# Altium schematic sheet 01.SchDoc
size 420 x 496 mm
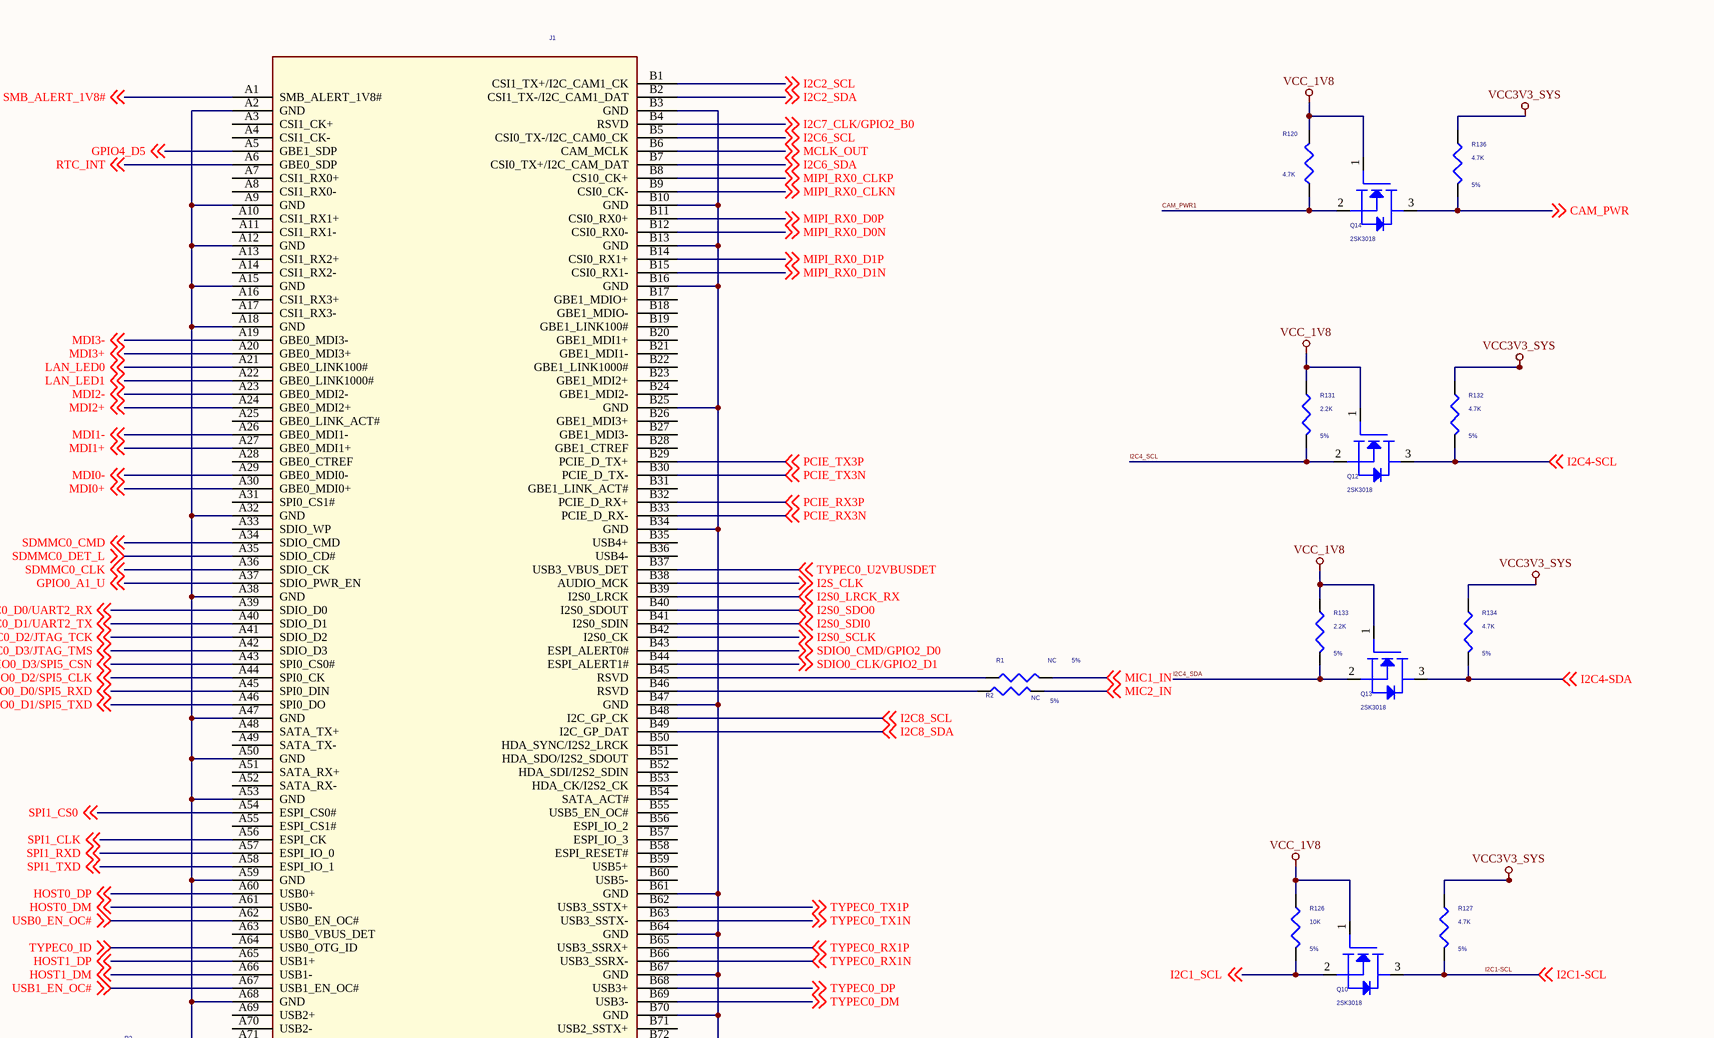
[diagram p0: 01.SchDoc, top]
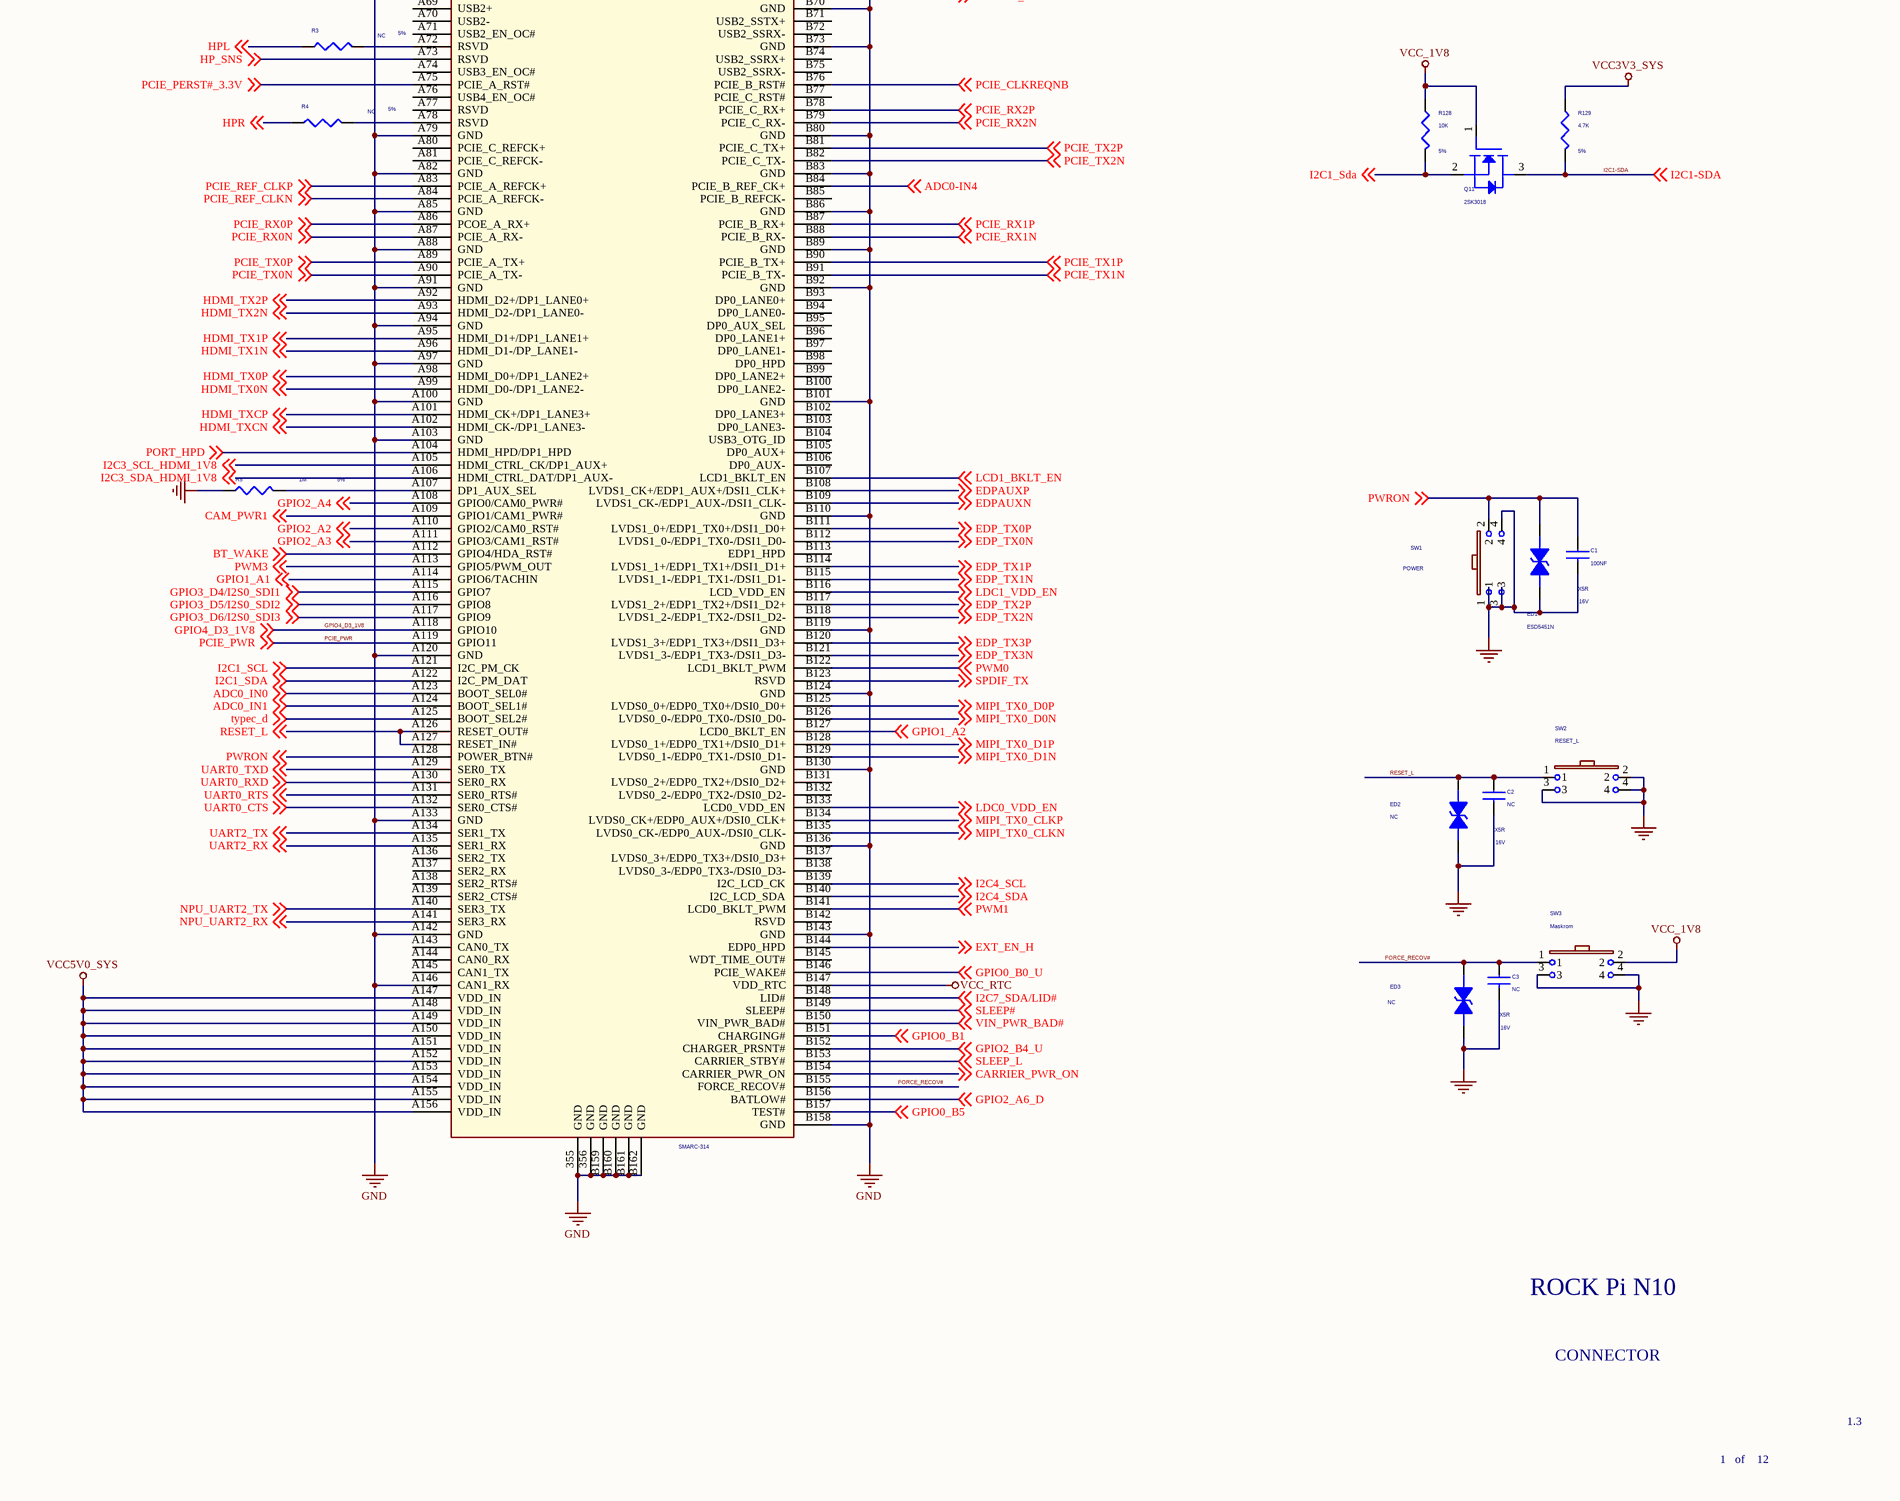
[diagram p1: 01.SchDoc, bottom]

## Parts
C1  100NF  Dielectric: X5R  Voltage: 16V  [C0402]
C2  NC  Dielectric: X5R  Voltage: 16V  [C0402]
C3  NC  Dielectric: X5R  Voltage: 16V  [C0402]
ED1  ESD5451N  [ESD0402]
ED2  NC  [ESD0402]
ED3  NC  [ESD0402]
J1  SMARC-314  [SMARC-314C]
Q10  2SK3018  [SOT23]
Q11  2SK3018  [SOT23]
Q12  2SK3018  [SOT23]
Q13  2SK3018  [SOT23]
Q14  2SK3018  [SOT23]
R1  NC  Tolerance: 5%  [R0402]
R2  NC  Tolerance: 5%  [R0402]
R3  NC  Tolerance: 5%  [R0402]
R4  NC  Tolerance: 5%  [R0402]
R5  1M  Tolerance: 5%  [R0402]
R120  4.7K  [R0402]
R126  10K  Tolerance: 5%  [R0402]
R127  4.7K  Tolerance: 5%  [R0402]
R128  10K  Tolerance: 5%  [R0402]
R129  4.7K  Tolerance: 5%  [R0402]
R131  2.2K  Tolerance: 5%  [R0402]
R132  4.7K  Tolerance: 5%  [R0402]
R133  2.2K  Tolerance: 5%  [R0402]
R134  4.7K  Tolerance: 5%  [R0402]
R136  4.7K  Tolerance: 5%  [R0402]
SW1  POWER  [YC-6615B]
SW2  RESET_L  [YC-6615B]
SW3  Maskrom  [YC-6615B]

## Nets
GND: C1.2 C2.2 C3.2 ED1.2 ED2.2 ED3.2 J1.355(GND) J1.356(GND) J1.A2(GND) J1.A9(GND) J1.A12(GND) J1.A15(GND) J1.A18(GND) J1.A32(GND) J1.A38(GND) J1.A47(GND) J1.A50(GND) J1.A53(GND) J1.A59(GND) J1.A68(GND) J1.A79(GND) J1.A82(GND) J1.A85(GND) J1.A88(GND) J1.A91(GND) J1.A94(GND) J1.A97(GND) J1.A100(GND) J1.A103(GND) J1.A120(GND) J1.A133(GND) J1.A142(GND) J1.A146(CAN1_RX) J1.B3(GND) J1.B10(GND) J1.B13(GND) J1.B16(GND) J1.B25(GND) J1.B34(GND) J1.B47(GND) J1.B61(GND) J1.B64(GND) J1.B67(GND) J1.B70(GND) J1.B73(GND) J1.B80(GND) J1.B83(GND) J1.B86(GND) J1.B89(GND) J1.B92(GND) J1.B101(GND) J1.B110(GND) J1.B119(GND) J1.B124(GND) J1.B130(GND) J1.B136(GND) J1.B143(GND) J1.B158(GND) J1.B159(GND) J1.B160(GND) J1.B161(GND) J1.B162(GND) R5.1 SW1.1 SW1.3 SW1.4 SW2.2 SW2.3 SW2.4 SW3.3 SW3.4
VCC3V3_SYS: R127.1 R129.1 R132.1 R134.1 R136.1
VCC5V0_SYS: J1.A147(VDD_IN) J1.A148(VDD_IN) J1.A149(VDD_IN) J1.A150(VDD_IN) J1.A151(VDD_IN) J1.A152(VDD_IN) J1.A153(VDD_IN) J1.A154(VDD_IN) J1.A155(VDD_IN) J1.A156(VDD_IN)
VCC_1V8: Q10.1(GATE) Q11.1(GATE) Q12.1(GATE) Q13.1(GATE) Q14.1(GATE) R120.2 R126.1 R128.1 R131.1 R133.1 SW3.2
VCC_RTC: J1.B147(VDD_RTC)
ADC0-IN4: J1.B84(PCIE_B_REF_CK+) ; off-sheet ADC0-IN4
ADC0_IN0: J1.A123(BOOT_SEL0#) ; off-sheet ADC0_IN0
ADC0_IN1: J1.A124(BOOT_SEL1#) ; off-sheet ADC0_IN1
BT_WAKE: J1.A112(GPIO4/HDA_RST#) ; off-sheet BT_WAKE
CAM_PWR: Q14.3(DRAIN) R136.2 ; off-sheet CAM_PWR
CAM_PWR1: J1.A109(GPIO1/CAM1_PWR#) Q14.2(SOURCE) R120.1 ; off-sheet CAM_PWR1
CARRIER_PWR_ON: J1.B154(CARRIER_PWR_ON) ; off-sheet CARRIER_PWR_ON
EDP_TX0N: J1.B112(LVDS1_0-/EDP1_TX0-/DSI1_D0-) ; off-sheet EDP_TX0N
EDP_TX0P: J1.B111(LVDS1_0+/EDP1_TX0+/DSI1_D0+) ; off-sheet EDP_TX0P
EDP_TX1N: J1.B115(LVDS1_1-/EDP1_TX1-/DSI1_D1-) ; off-sheet EDP_TX1N
EDP_TX1P: J1.B114(LVDS1_1+/EDP1_TX1+/DSI1_D1+) ; off-sheet EDP_TX1P
EDP_TX2N: J1.B118(LVDS1_2-/EDP1_TX2-/DSI1_D2-) ; off-sheet EDP_TX2N
EDP_TX2P: J1.B117(LVDS1_2+/EDP1_TX2+/DSI1_D2+) ; off-sheet EDP_TX2P
EDP_TX3N: J1.B121(LVDS1_3-/EDP1_TX3-/DSI1_D3-) ; off-sheet EDP_TX3N
EDP_TX3P: J1.B120(LVDS1_3+/EDP1_TX3+/DSI1_D3+) ; off-sheet EDP_TX3P
EDPAUXN: J1.B109(LVDS1_CK-/EDP1_AUX-/DSI1_CLK-) ; off-sheet EDPAUXN
EDPAUXP: J1.B108(LVDS1_CK+/EDP1_AUX+/DSI1_CLK+) ; off-sheet EDPAUXP
EXT_EN_H: J1.B144(EDP0_HPD) ; off-sheet EXT_EN_H
FORCE_RECOV#: C3.1 ED3.1 J1.B155(FORCE_RECOV#) SW3.1
GPIO0_A1_U: J1.A37(SDIO_PWR_EN) ; off-sheet GPIO0_A1_U
GPIO0_B0_U: J1.B146(PCIE_WAKE#) ; off-sheet GPIO0_B0_U
GPIO0_B1: J1.B151(CHARGING#) ; off-sheet GPIO0_B1
GPIO0_B5: J1.B157(TEST#) ; off-sheet GPIO0_B5
GPIO1_A1: J1.A114(GPIO6/TACHIN) ; off-sheet GPIO1_A1
GPIO1_A2: J1.B127(LCD0_BKLT_EN) ; off-sheet GPIO1_A2
GPIO2_A2: J1.A110(GPIO2/CAM0_RST#) ; off-sheet GPIO2_A2
GPIO2_A3: J1.A111(GPIO3/CAM1_RST#) ; off-sheet GPIO2_A3
GPIO2_A4: J1.A108(GPIO0/CAM0_PWR#) ; off-sheet GPIO2_A4
GPIO2_A6_D: J1.B156(BATLOW#) ; off-sheet GPIO2_A6_D
GPIO2_B4_U: J1.B152(CHARGER_PRSNT#) ; off-sheet GPIO2_B4_U
GPIO3_D4/I2S0_SDI1: J1.A115(GPIO7) ; off-sheet GPIO3_D4/I2S0_SDI1
GPIO3_D5/I2S0_SDI2: J1.A116(GPIO8) ; off-sheet GPIO3_D5/I2S0_SDI2
GPIO3_D6/I2S0_SDI3: J1.A117(GPIO9) ; off-sheet GPIO3_D6/I2S0_SDI3
GPIO4_D3_1V8: J1.A118(GPIO10) ; off-sheet GPIO4_D3_1V8
GPIO4_D5: J1.A5(GBE1_SDP) ; off-sheet GPIO4_D5
HDMI_TX0N: J1.A99(HDMI_D0-/DP1_LANE2-) ; off-sheet HDMI_TX0N
HDMI_TX0P: J1.A98(HDMI_D0+/DP1_LANE2+) ; off-sheet HDMI_TX0P
HDMI_TX1N: J1.A96(HDMI_D1-/DP_LANE1-) ; off-sheet HDMI_TX1N
HDMI_TX1P: J1.A95(HDMI_D1+/DP1_LANE1+) ; off-sheet HDMI_TX1P
HDMI_TX2N: J1.A93(HDMI_D2-/DP1_LANE0-) ; off-sheet HDMI_TX2N
HDMI_TX2P: J1.A92(HDMI_D2+/DP1_LANE0+) ; off-sheet HDMI_TX2P
HDMI_TXCN: J1.A102(HDMI_CK-/DP1_LANE3-) ; off-sheet HDMI_TXCN
HDMI_TXCP: J1.A101(HDMI_CK+/DP1_LANE3+) ; off-sheet HDMI_TXCP
HOST0_DM: J1.A61(USB0-) ; off-sheet HOST0_DM
HOST0_DP: J1.A60(USB0+) ; off-sheet HOST0_DP
HOST1_DM: J1.A66(USB1-) ; off-sheet HOST1_DM
HOST1_DP: J1.A65(USB1+) ; off-sheet HOST1_DP
HP_SNS: J1.A73(RSVD) ; off-sheet HP_SNS
HPL: R3.1 ; off-sheet HPL
HPR: R4.1 ; off-sheet HPR
I2C1-SCL: Q10.3(DRAIN) R127.2 ; off-sheet I2C1-SCL
I2C1-SDA: Q11.3(DRAIN) R129.2 ; off-sheet I2C1-SDA
I2C1_SCL: J1.A121(I2C_PM_CK) Q10.2(SOURCE) R126.2 ; off-sheet I2C1_SCL
I2C1_SDA: J1.A122(I2C_PM_DAT) Q11.2(SOURCE) R128.2 ; off-sheet I2C1_SDA, off-sheet I2C1_Sda
I2C2_SCL: J1.B1(CSI1_TX+/I2C_CAM1_CK) ; off-sheet I2C2_SCL
I2C2_SDA: J1.B2(CSI1_TX-/I2C_CAM1_DAT) ; off-sheet I2C2_SDA
I2C3_SCL_HDMI_1V8: J1.A105(HDMI_CTRL_CK/DP1_AUX+) ; off-sheet I2C3_SCL_HDMI_1V8
I2C3_SDA_HDMI_1V8: J1.A106(HDMI_CTRL_DAT/DP1_AUX-) ; off-sheet I2C3_SDA_HDMI_1V8
I2C4-SCL: Q12.3(DRAIN) R132.2 ; off-sheet I2C4-SCL
I2C4-SDA: Q13.3(DRAIN) R134.2 ; off-sheet I2C4-SDA
I2C4_SCL: J1.B139(I2C_LCD_CK) Q12.2(SOURCE) R131.2 ; off-sheet I2C4_SCL
I2C4_SDA: J1.B140(I2C_LCD_SDA) Q13.2(SOURCE) R133.2 ; off-sheet I2C4_SDA
I2C6_SCL: J1.B5(CSI0_TX-/I2C_CAM0_CK) ; off-sheet I2C6_SCL
I2C6_SDA: J1.B7(CSI0_TX+/I2C_CAM_DAT) ; off-sheet I2C6_SDA
I2C7_CLK/GPIO2_B0: J1.B4(RSVD) ; off-sheet I2C7_CLK/GPIO2_B0
I2C7_SDA/LID#: J1.B148(LID#) ; off-sheet I2C7_SDA/LID#
I2C8_SCL: J1.B48(I2C_GP_CK) ; off-sheet I2C8_SCL
I2C8_SDA: J1.B49(I2C_GP_DAT) ; off-sheet I2C8_SDA
I2S0_LRCK_RX: J1.B39(I2S0_LRCK) ; off-sheet I2S0_LRCK_RX
I2S0_SCLK: J1.B42(I2S0_CK) ; off-sheet I2S0_SCLK
I2S0_SDI0: J1.B41(I2S0_SDIN) ; off-sheet I2S0_SDI0
I2S0_SDO0: J1.B40(I2S0_SDOUT) ; off-sheet I2S0_SDO0
I2S_CLK: J1.B38(AUDIO_MCK) ; off-sheet I2S_CLK
LAN_LED0: J1.A21(GBE0_LINK100#) ; off-sheet LAN_LED0
LAN_LED1: J1.A22(GBE0_LINK1000#) ; off-sheet LAN_LED1
LCD1_BKLT_EN: J1.B107(LCD1_BKLT_EN) ; off-sheet LCD1_BKLT_EN
LDC0_VDD_EN: J1.B133(LCD0_VDD_EN) ; off-sheet LDC0_VDD_EN
LDC1_VDD_EN: J1.B116(LCD_VDD_EN) ; off-sheet LDC1_VDD_EN
MCLK_OUT: J1.B6(CAM_MCLK) ; off-sheet MCLK_OUT
MDI0+: J1.A30(GBE0_MDI0+) ; off-sheet MDI0+
MDI0-: J1.A29(GBE0_MDI0-) ; off-sheet MDI0-
MDI1+: J1.A27(GBE0_MDI1+) ; off-sheet MDI1+
MDI1-: J1.A26(GBE0_MDI1-) ; off-sheet MDI1-
MDI2+: J1.A24(GBE0_MDI2+) ; off-sheet MDI2+
MDI2-: J1.A23(GBE0_MDI2-) ; off-sheet MDI2-
MDI3+: J1.A20(GBE0_MDI3+) ; off-sheet MDI3+
MDI3-: J1.A19(GBE0_MDI3-) ; off-sheet MDI3-
MIC1_IN: R1.2 ; off-sheet MIC1_IN
MIC2_IN: R2.2 ; off-sheet MIC2_IN
MIPI_RX0_CLKN: J1.B9(CSI0_CK-) ; off-sheet MIPI_RX0_CLKN
MIPI_RX0_CLKP: J1.B8(CS10_CK+) ; off-sheet MIPI_RX0_CLKP
MIPI_RX0_D0N: J1.B12(CSI0_RX0-) ; off-sheet MIPI_RX0_D0N
MIPI_RX0_D0P: J1.B11(CSI0_RX0+) ; off-sheet MIPI_RX0_D0P
MIPI_RX0_D1N: J1.B15(CSI0_RX1-) ; off-sheet MIPI_RX0_D1N
MIPI_RX0_D1P: J1.B14(CSI0_RX1+) ; off-sheet MIPI_RX0_D1P
MIPI_TX0_CLKN: J1.B135(LVDS0_CK-/EDP0_AUX-/DSI0_CLK-) ; off-sheet MIPI_TX0_CLKN
MIPI_TX0_CLKP: J1.B134(LVDS0_CK+/EDP0_AUX+/DSI0_CLK+) ; off-sheet MIPI_TX0_CLKP
MIPI_TX0_D0N: J1.B126(LVDS0_0-/EDP0_TX0-/DSI0_D0-) ; off-sheet MIPI_TX0_D0N
MIPI_TX0_D0P: J1.B125(LVDS0_0+/EDP0_TX0+/DSI0_D0+) ; off-sheet MIPI_TX0_D0P
MIPI_TX0_D1N: J1.B129(LVDS0_1-/EDP0_TX1-/DSI0_D1-) ; off-sheet MIPI_TX0_D1N
MIPI_TX0_D1P: J1.B128(LVDS0_1+/EDP0_TX1+/DSI0_D1+) ; off-sheet MIPI_TX0_D1P
NPU_UART2_RX: J1.A141(SER3_RX) ; off-sheet NPU_UART2_RX
NPU_UART2_TX: J1.A140(SER3_TX) ; off-sheet NPU_UART2_TX
PCIE_CLKREQNB: J1.B76(PCIE_B_RST#) ; off-sheet PCIE_CLKREQNB
PCIE_PERST#_3.3V: J1.A75(PCIE_A_RST#) ; off-sheet PCIE_PERST#_3.3V
PCIE_PWR: J1.A119(GPIO11) ; off-sheet PCIE_PWR
PCIE_REF_CLKN: J1.A84(PCIE_A_REFCK-) ; off-sheet PCIE_REF_CLKN
PCIE_REF_CLKP: J1.A83(PCIE_A_REFCK+) ; off-sheet PCIE_REF_CLKP
PCIE_RX0N: J1.A87(PCIE_A_RX-) ; off-sheet PCIE_RX0N
PCIE_RX0P: J1.A86(PCOE_A_RX+) ; off-sheet PCIE_RX0P
PCIE_RX1N: J1.B88(PCIE_B_RX-) ; off-sheet PCIE_RX1N
PCIE_RX1P: J1.B87(PCIE_B_RX+) ; off-sheet PCIE_RX1P
PCIE_RX2N: J1.B79(PCIE_C_RX-) ; off-sheet PCIE_RX2N
PCIE_RX2P: J1.B78(PCIE_C_RX+) ; off-sheet PCIE_RX2P
PCIE_RX3N: J1.B33(PCIE_D_RX-) ; off-sheet PCIE_RX3N
PCIE_RX3P: J1.B32(PCIE_D_RX+) ; off-sheet PCIE_RX3P
PCIE_TX0N: J1.A90(PCIE_A_TX-) ; off-sheet PCIE_TX0N
PCIE_TX0P: J1.A89(PCIE_A_TX+) ; off-sheet PCIE_TX0P
PCIE_TX1N: J1.B91(PCIE_B_TX-) ; off-sheet PCIE_TX1N
PCIE_TX1P: J1.B90(PCIE_B_TX+) ; off-sheet PCIE_TX1P
PCIE_TX2N: J1.B82(PCIE_C_TX-) ; off-sheet PCIE_TX2N
PCIE_TX2P: J1.B81(PCIE_C_TX+) ; off-sheet PCIE_TX2P
PCIE_TX3N: J1.B30(PCIE_D_TX-) ; off-sheet PCIE_TX3N
PCIE_TX3P: J1.B29(PCIE_D_TX+) ; off-sheet PCIE_TX3P
PORT_HPD: J1.A104(HDMI_HPD/DP1_HPD) ; off-sheet PORT_HPD
PWM0: J1.B122(LCD1_BKLT_PWM) ; off-sheet PWM0
PWM1: J1.B141(LCD0_BKLT_PWM) ; off-sheet PWM1
PWM3: J1.A113(GPIO5/PWM_OUT) ; off-sheet PWM3
PWRON: C1.1 ED1.1 J1.A128(POWER_BTN#) SW1.2 ; off-sheet PWRON
RESET_L: C2.1 ED2.1 J1.A126(RESET_OUT#) J1.A127(RESET_IN#) SW2.1 ; off-sheet RESET_L
RTC_INT: J1.A6(GBE0_SDP) ; off-sheet RTC_INT
SDIO0_CLK/GPIO2_D1: J1.B44(ESPI_ALERT1#) ; off-sheet SDIO0_CLK/GPIO2_D1
SDIO0_CMD/GPIO2_D0: J1.B43(ESPI_ALERT0#) ; off-sheet SDIO0_CMD/GPIO2_D0
SDIO0_D0/SPI5_RXD: J1.A45(SPI0_DIN) ; off-sheet SDIO0_D0/SPI5_RXD
SDIO0_D1/SPI5_TXD: J1.A46(SPI0_DO) ; off-sheet SDIO0_D1/SPI5_TXD
SDIO0_D2/SPI5_CLK: J1.A44(SPI0_CK) ; off-sheet SDIO0_D2/SPI5_CLK
SDIO0_D3/SPI5_CSN: J1.A43(SPI0_CS0#) ; off-sheet SDIO0_D3/SPI5_CSN
SDMMC0_CLK: J1.A36(SDIO_CK) ; off-sheet SDMMC0_CLK
SDMMC0_CMD: J1.A34(SDIO_CMD) ; off-sheet SDMMC0_CMD
SDMMC0_D0/UART2_RX: J1.A39(SDIO_D0) ; off-sheet SDMMC0_D0/UART2_RX
SDMMC0_D1/UART2_TX: J1.A40(SDIO_D1) ; off-sheet SDMMC0_D1/UART2_TX
SDMMC0_D2/JTAG_TCK: J1.A41(SDIO_D2) ; off-sheet SDMMC0_D2/JTAG_TCK
SDMMC0_D3/JTAG_TMS: J1.A42(SDIO_D3) ; off-sheet SDMMC0_D3/JTAG_TMS
SDMMC0_DET_L: J1.A35(SDIO_CD#) ; off-sheet SDMMC0_DET_L
SLEEP#: J1.B149(SLEEP#) ; off-sheet SLEEP#
SLEEP_L: J1.B153(CARRIER_STBY#) ; off-sheet SLEEP_L
SMB_ALERT_1V8#: J1.A1(SMB_ALERT_1V8#) ; off-sheet SMB_ALERT_1V8#
SPDIF_TX: J1.B123(RSVD) ; off-sheet SPDIF_TX
SPI1_CLK: J1.A56(ESPI_CK) ; off-sheet SPI1_CLK
SPI1_CS0: J1.A54(ESPI_CS0#) ; off-sheet SPI1_CS0
SPI1_RXD: J1.A57(ESPI_IO_0) ; off-sheet SPI1_RXD
SPI1_TXD: J1.A58(ESPI_IO_1) ; off-sheet SPI1_TXD
TYPEC0_DM: J1.B69(USB3-) ; off-sheet TYPEC0_DM
TYPEC0_DP: J1.B68(USB3+) ; off-sheet TYPEC0_DP
TYPEC0_ID: J1.A64(USB0_OTG_ID) ; off-sheet TYPEC0_ID
TYPEC0_RX1N: J1.B66(USB3_SSRX-) ; off-sheet TYPEC0_RX1N
TYPEC0_RX1P: J1.B65(USB3_SSRX+) ; off-sheet TYPEC0_RX1P
TYPEC0_TX1N: J1.B63(USB3_SSTX-) ; off-sheet TYPEC0_TX1N
TYPEC0_TX1P: J1.B62(USB3_SSTX+) ; off-sheet TYPEC0_TX1P
TYPEC0_U2VBUSDET: J1.B37(USB3_VBUS_DET) ; off-sheet TYPEC0_U2VBUSDET
typec_d: J1.A125(BOOT_SEL2#) ; off-sheet typec_d
UART0_CTS: J1.A132(SER0_CTS#) ; off-sheet UART0_CTS
UART0_RTS: J1.A131(SER0_RTS#) ; off-sheet UART0_RTS
UART0_RXD: J1.A130(SER0_RX) ; off-sheet UART0_RXD
UART0_TXD: J1.A129(SER0_TX) ; off-sheet UART0_TXD
UART2_RX: J1.A135(SER1_RX) ; off-sheet UART2_RX
UART2_TX: J1.A134(SER1_TX) ; off-sheet UART2_TX
USB0_EN_OC#: J1.A62(USB0_EN_OC#) ; off-sheet USB0_EN_OC#
USB1_EN_OC#: J1.A67(USB1_EN_OC#) ; off-sheet USB1_EN_OC#
VIN_PWR_BAD#: J1.B150(VIN_PWR_BAD#) ; off-sheet VIN_PWR_BAD#
NetJ1_A72: J1.A72(RSVD) R3.2
NetJ1_A78: J1.A78(RSVD) R4.2
NetJ1_A107: J1.A107(DP1_AUX_SEL) R5.2
NetJ1_B45: J1.B45(RSVD) R1.1
NetJ1_B46: J1.B46(RSVD) R2.1

Not connected (* = marked no-connect by the designer): J1 A3(CSI1_CK+) A4(CSI1_CK-) A7(CSI1_RX0+) A8(CSI1_RX0-) A10(CSI1_RX1+) A11(CSI1_RX1-) A13(CSI1_RX2+) A14(CSI1_RX2-) A16(CSI1_RX3+) A17(CSI1_RX3-) A25(GBE0_LINK_ACT#) A28(GBE0_CTREF) A31(SPI0_CS1#) A33(SDIO_WP) A48(SATA_TX+) A49(SATA_TX-) A51(SATA_RX+) A52(SATA_RX-) A55(ESPI_CS1#) A63(USB0_VBUS_DET) A69(USB2+) A70(USB2-) A71(USB2_EN_OC#) A74(USB3_EN_OC#) A76(USB4_EN_OC#) A77(RSVD) A80(PCIE_C_REFCK+) A81(PCIE_C_REFCK-) A136(SER2_TX) A137(SER2_RX) A138(SER2_RTS#) A139(SER2_CTS#) A143(CAN0_TX) A144(CAN0_RX) A145(CAN1_TX) B17(GBE1_MDIO+) B18(GBE1_MDIO-) B19(GBE1_LINK100#) B20(GBE1_MDI1+) B21(GBE1_MDI1-) B22(GBE1_LINK1000#) B23(GBE1_MDI2+) B24(GBE1_MDI2-) B26(GBE1_MDI3+) B27(GBE1_MDI3-) B28(GBE1_CTREF) B31(GBE1_LINK_ACT#) B35(USB4+) B36(USB4-) B50(HDA_SYNC/I2S2_LRCK) B51(HDA_SDO/I2S2_SDOUT) B52(HDA_SDI/I2S2_SDIN) B53(HDA_CK/I2S2_CK) B54(SATA_ACT#) B55(USB5_EN_OC#) B56(ESPI_IO_2) B57(ESPI_IO_3) B58(ESPI_RESET#) B59(USB5+) B60(USB5-) B71(USB2_SSTX+) B72(USB2_SSRX-) B74(USB2_SSRX+) B75(USB2_SSRX-) B77(PCIE_C_RST#) B85(PCIE_B_REFCK-) B93(DP0_LANE0+) B94(DP0_LANE0-) B95(DP0_AUX_SEL) B96(DP0_LANE1+) B97(DP0_LANE1-) B98(DP0_HPD) B99(DP0_LANE2+) B100(DP0_LANE2-) B102(DP0_LANE3+) B103(DP0_LANE3-) B104(USB3_OTG_ID) B105(DP0_AUX+) B106(DP0_AUX-) B113(EDP1_HPD) B131(LVDS0_2+/EDP0_TX2+/DSI0_D2+) B132(LVDS0_2-/EDP0_TX2-/DSI0_D2-) B137(LVDS0_3+/EDP0_TX3+/DSI0_D3+) B138(LVDS0_3-/EDP0_TX3-/DSI0_D3-) B142(RSVD) B145(WDT_TIME_OUT#)

## Notes on the sheet
- ROCK Pi N10
- CONNECTOR
- 1.3
- 1   of    12

## Library data of the parts
C1 = CAP NP_2: cap,100.00nF,+/-10%,16V,X5R,C0402; Manufacturer: TDK; RK PN: C1005X5R1C104K050BA; Priority: A; Tolerance: 10%; Part Type: C0402; Manufacturer PN: C1005X5R1C104K050BA; Created by: JJJ
C2 C3 = CAP NP_2: cap,100.00nF,+/-10%,16V,X5R,C0402; Manufacturer PN: C1005X5R1C104K050BA; Manufacturer: TDK; Tolerance: 10%; Priority: A; Created by: JJJ; Part Type: C0402; RK PN: C1005X5R1C104K050BA
ED1 = DIODE BI_DIR TRIG_0: 1-Line, Bi-directional, Transient Voltage Suppressors.17.5pF.; Manufacturer: WillSemi(韦尔半导体); Priority: A; RK PN: ESD5451N; Part Type: ESD_TVS; Manufacturer PN: ESD5451N; Created by: JJJ
ED2 = DIODE BI_DIR TRIG_0: 1-Line, Bi-directional, Transient Voltage Suppressors.17.5pF.; Manufacturer: WillSemi(韦尔半导体); RK PN: ESD5451N; Priority: A; Part Type: ESD_TVS; Manufacturer PN: ESD5451N; Created by: JJJ
ED3 = DIODE BI_DIR TRIG_0: 1-Line, Bi-directional, Transient Voltage Suppressors.17.5pF.; Manufacturer PN: ESD5451N; Manufacturer: WillSemi(韦尔半导体); Priority: A; Created by: JJJ; Part Type: ESD_TVS; RK PN: ESD5451N
J1 = SMARC-314_3
Q10-Q13 = MOSFET N: NMOS,2SK3018,SOT_323,Id=0.1A,Vds=30V; Manufacturer: ROHM; Rds: 5ohm; Priority: A; Id_max: 0.1A; Vgs: 20V; VDS: 30V; Vgsth: 1.5V; Pd: 0.2W; RK PN: 2SK3018; Part Type: NMOS; Manufacturer PN: 2SK3018; Created by: JJJ
Q14 = MOSFET N: NMOS,2SK3018,SOT_323,Id=0.1A,Vds=30V; Manufacturer: ROHM; Pd: 0.2W; Vgsth: 1.5V; VDS: 30V; Vgs: 20V; Id_max: 0.1A; Priority: A; Rds: 5ohm; Created by: JJJ; Manufacturer PN: 2SK3018; Part Type: NMOS; RK PN: 2SK3018
R1 R4 R5 = RESISTOR_3: 通用厚膜电阻,22R,+/-5%,R0402,1/16W.; Manufacturer PN: RC0402JR-0722RL; Manufacturer: YAGEO; Wattage: 1/16W; Priority: A; Created by: YTL; Part Type: 通用厚膜电阻; RK PN: RC0402JR-0722RL
R2 R3 = RESISTOR_3: 通用厚膜电阻,22R,+/-5%,R0402,1/16W.; Manufacturer: YAGEO; RK PN: RC0402JR-0722RL; Priority: A; Wattage: 1/16W; Part Type: 通用厚膜电阻; Manufacturer PN: RC0402JR-0722RL; Created by: YTL
R120 = R_2: SMD  0402  4.7K  1/16W  ±5%  ROHS
R126 R128 R131 R133 = RESISTOR_3: 通用厚膜电阻,10K,+/-5%,R0402,1/16W.; Manufacturer PN: RC0402JR-0710KL; Manufacturer: YAGEO; Wattage: 1/16W; Priority: A; Created by: YTL; Part Type: 通用厚膜电阻; RK PN: RC0402JR-0710KL
R127 R129 R132 R134 R136 = RESISTOR_3: 通用厚膜电阻,4.7K,+/-5%,R0402,1/16W.; Manufacturer PN: RC0402JR-071K5L; Manufacturer: YAGEO; Wattage: 1/16W; Priority: A; Created by: YTL; Part Type: 通用厚膜电阻; RK PN: RC0402JR-071K5L
SW1-SW3 = KEY_4PIN: 按键，5mm*5mm，直按，插焊; Manufacturer Part Number: KEY_5X5; Manufacturer: 旺科达; Priority: A; Created by: JJJ; Part Type: KEY; RK PN: KEY_5X5